# EAGLE schematic Sensor_Module_0x12_U-Value_v1 (EAGLE 9.1.1)
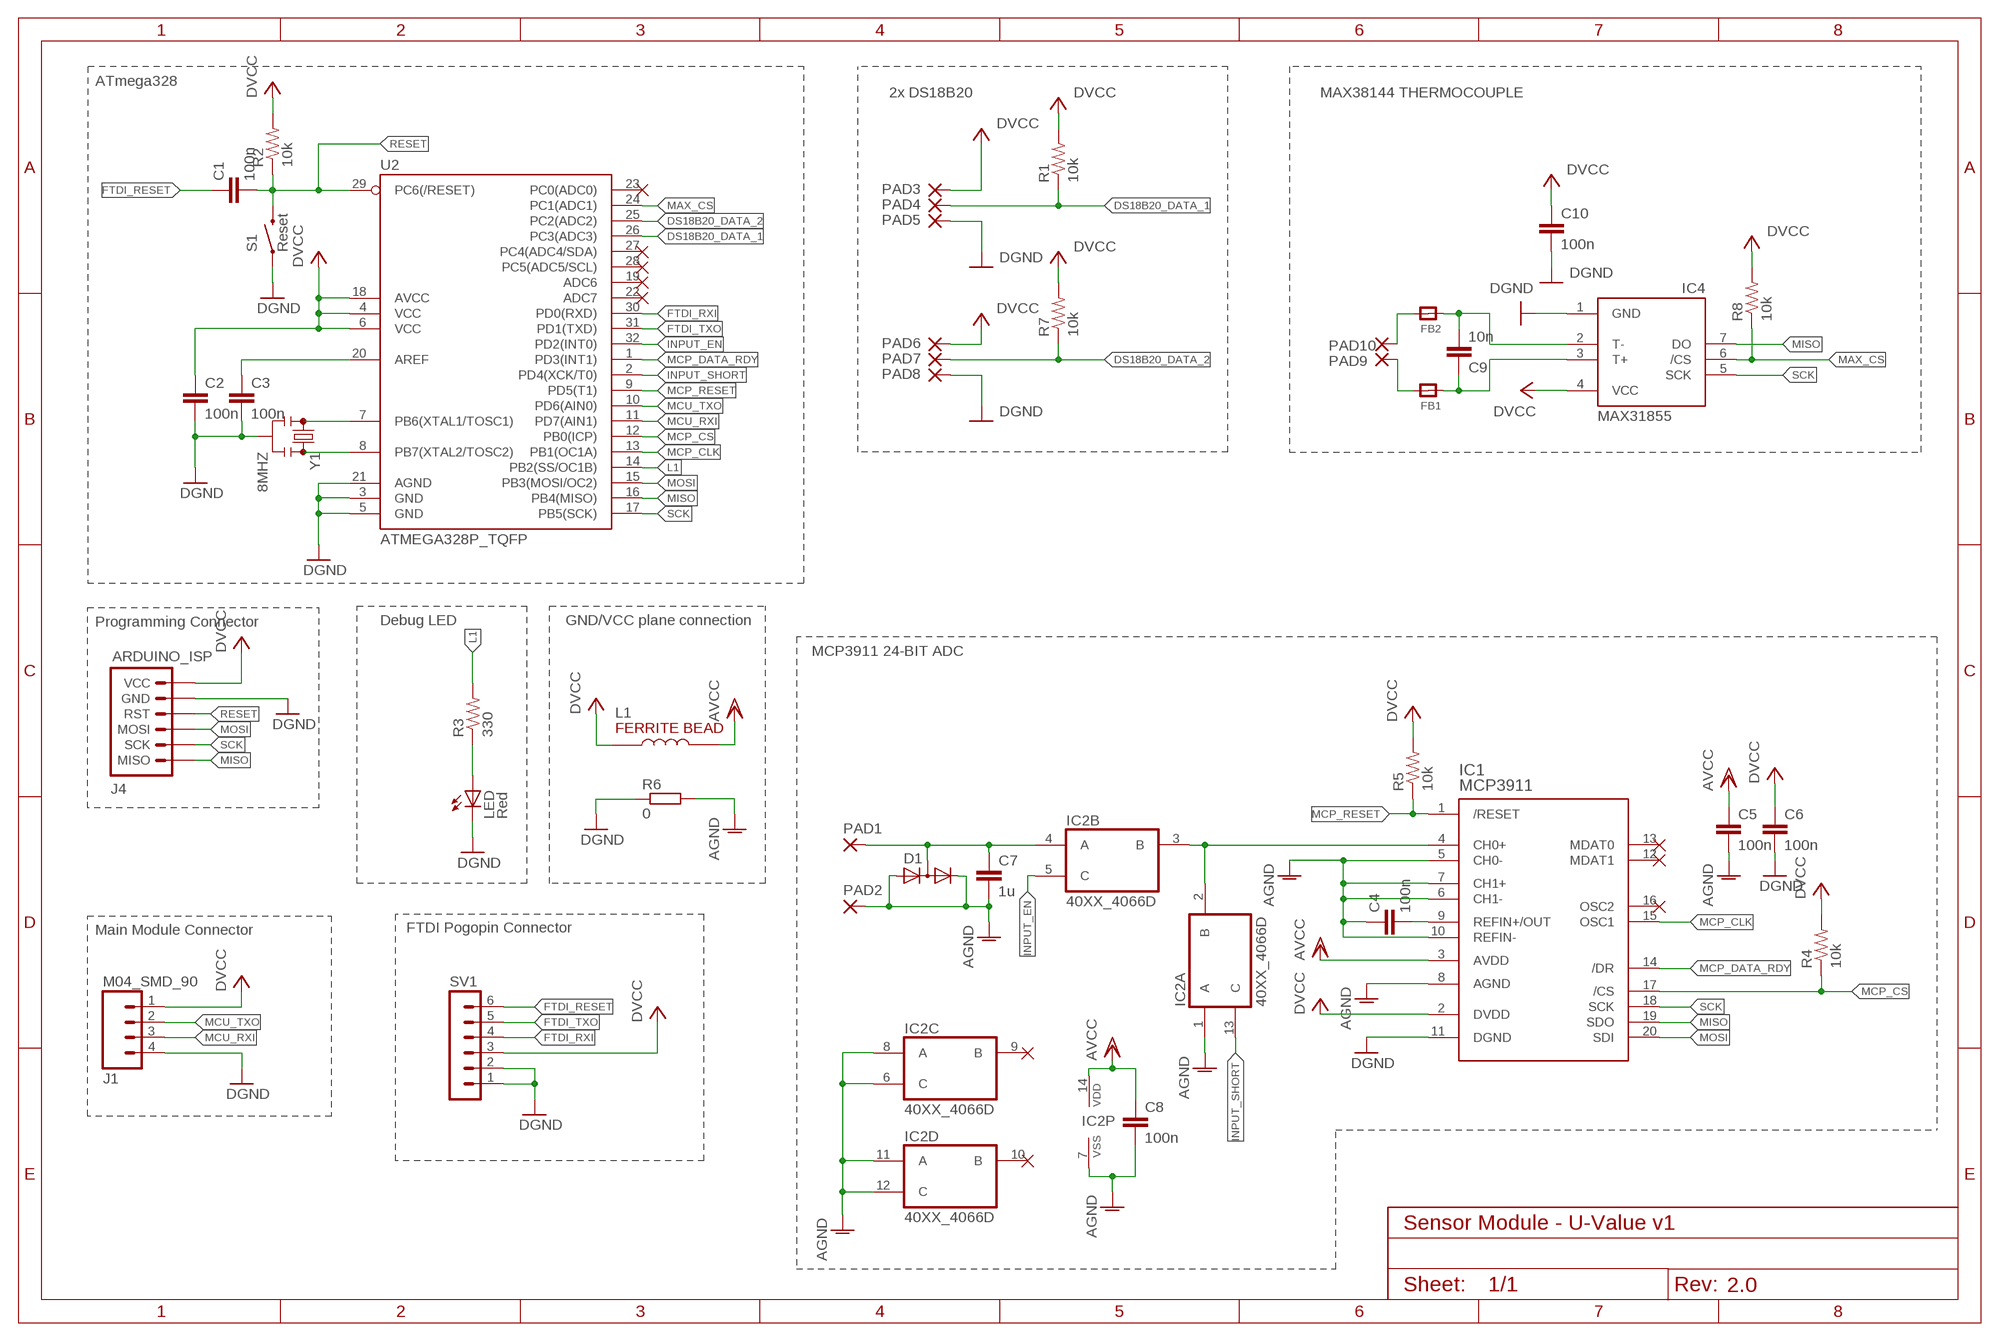
[diagram p0: schematic, sheet 1]
FRAME1 (FRAME-A4L): CNAME: Communication Module; CREVISION: 2.0

## Parts
C1  100n  C  [C0805]
C2  100n  C  [C0805]
C3  100n  C  [C0805]
C4  100n  C  [C0805]
C5  100n  C  [C0805]
C6  100n  C  [C0805]
C7  1u  C  [C0805]
C8  100n  C  [C0805]
C9  10n  C  [C0805]
C10  100n  C  [C0805]
D1  LEDXLAMP_BAV99  [LEDXLAMP_SOT23]
FB1  MICROBUILDER_FERRITE_0805MP  [MICROBUILDER__0805MP]
FB2  MICROBUILDER_FERRITE_0805MP  [MICROBUILDER__0805MP]
IC1  MCP3911  HEATFLOW_MCP3911A0-E/SS  [HEATFLOW_SSOP20]
IC2  40XX_4066D  [40XX_SO14]
IC4  MAX31855  ADAFRUIT_MAX31855  [ADAFRUIT_SO08]
J1  M04_SMD_90  [M04_SMD_90]
J4  ARDUINO_ISP  [M-2X3]
L1  HEATFLOW2_74279220601  [HEATFLOW2_0805]
LED  Red  LEDSML0805  [SML0805]
PAD1  WIREPADSMD1,27-254  [SMD1,27-2,54]
PAD2  WIREPADSMD1,27-254  [SMD1,27-2,54]
PAD3  WIREPADSMD1,27-254  [SMD1,27-2,54]
PAD4  WIREPADSMD1,27-254  [SMD1,27-2,54]
PAD5  WIREPADSMD1,27-254  [SMD1,27-2,54]
PAD6  WIREPADSMD1,27-254  [SMD1,27-2,54]
PAD7  WIREPADSMD1,27-254  [SMD1,27-2,54]
PAD8  WIREPADSMD1,27-254  [SMD1,27-2,54]
PAD9  WIREPADSMD1,27-254  [SMD1,27-2,54]
PAD10  WIREPADSMD1,27-254  [SMD1,27-2,54]
R1  10k  RESISTOR0805-RES  [0805]
R2  10k  RESISTOR0805-RES  [0805]
R3  330  RESISTOR0805-RES  [0805]
R4  10k  RESISTOR0805-RES  [0805]
R5  10k  RESISTOR0805-RES  [0805]
R6  0  RESISTOR_R-EU_M0805  [RESISTOR_M0805]
R7  10k  RESISTOR0805-RES  [0805]
R8  10k  RESISTOR0805-RES  [0805]
S1  Reset  PUSHBUTTON  [M-PUSHBUTTON-SMD]
SV1  MA06-1  [MA06-1]
U2  ATMEGA328P_TQFP  [TQFP32-08]
Y1  8MHZ  RESONATOR8MHZ  [RESONATOR-SMD]

## Nets
AGND: C4.1 C5.2 C7.2 C8.2 D1.1(A) D1.2(C) IC1.5(CH0-) IC1.6(CH1-) IC1.7(CH1+) IC1.8(AGND) IC1.10(REFIN-) IC2.1(A:A) IC2.6(C:C) IC2.7(P:VSS) IC2.8(C:A) IC2.11(D:A) IC2.12(D:C) PAD2.1(P) R6.2
AVCC: C5.1 C8.1 IC1.3(AVDD) IC2.14(P:VDD) L1.2
DGND [GND]: C2.2 C3.2 C6.2 C10.2 IC1.11(DGND) IC4.1(GND) J1.4 J4.P$5(GND) LED.C PAD5.1(P) PAD8.1(P) R6.1 S1.1(LEFT) S1.2(LEFT) SV1.1 SV1.2 U2.3(GND) U2.5(GND) U2.21(AGND) Y1.2
DS18B20_DATA_1: PAD4.1(P) R1.1 U2.26(PC3(ADC3))
DS18B20_DATA_2: PAD7.1(P) R7.1 U2.25(PC2(ADC2))
DVCC [Vsupply]: C2.1 C6.1 C10.1 IC1.2(DVDD) IC4.4(VCC) J1.1 J4.P$6(VCC) L1.1 PAD3.1(P) PAD6.1(P) R1.2 R2.2 R4.2 R5.2 R7.2 R8.2 SV1.3 U2.4(VCC) U2.6(VCC) U2.18(AVCC)
FTDI_RESET: C1.1 SV1.6
FTDI_RXI: SV1.4 U2.30(PD0(RXD))
FTDI_TXO: SV1.5 U2.31(PD1(TXD))
INPUT_EN: IC2.5(B:C) U2.32(PD2(INT0))
INPUT_SHORT: IC2.13(A:C) U2.2(PD4(XCK/T0))
L1: R3.2 U2.14(PB2(SS/OC1B))
MAX_CS: IC4.6(/CS) R8.1 U2.24(PC1(ADC1))
MCP_CLK: IC1.15(OSC1) U2.13(PB1(OC1A))
MCP_CS: IC1.17(/CS) R4.1 U2.12(PB0(ICP))
MCP_DATA_RDY: IC1.14(/DR) U2.1(PD3(INT1))
MCP_RESET: IC1.1(/RESET) R5.1 U2.9(PD5(T1))
MCU_RXI: J1.3 U2.11(PD7(AIN1))
MCU_TXO: J1.2 U2.10(PD6(AIN0))
MISO: IC1.19(SDO) IC4.7(DO) J4.P$1(MISO) U2.16(PB4(MISO))
MOSI: IC1.20(SDI) J4.P$3(MOSI) U2.15(PB3(MOSI/OC2))
N$1: U2.8(PB7(XTAL2/TOSC2)) Y1.3
N$2: U2.7(PB6(XTAL1/TOSC1)) Y1.1
N$3: FB1.1 PAD9.1(P)
N$4: C4.2 IC1.9(REFIN+/OUT)
N$5: IC1.4(CH0+) IC2.2(A:B) IC2.3(B:B)
N$6: C7.1 D1.3(AC) IC2.4(B:A) PAD1.1(P)
N$7: FB2.1 PAD10.1(P)
N$8: C9.2 FB2.2 IC4.2(T-)
N$9: C9.1 FB1.2 IC4.3(T+)
N$15: C3.1 U2.20(AREF)
N$30: LED.A R3.1
RESET: C1.2 J4.P$4(RST) R2.1 S1.3(RIGHT) S1.4(RIGHT) U2.29(PC6(/RESET))
SCK: IC1.18(SCK) IC4.5(SCK) J4.P$2(SCK) U2.17(PB5(SCK))
Unconnected: IC1.12(MDAT1) IC1.13(MDAT0) IC1.16(OSC2) IC2.9(C:B) IC2.10(D:B) U2.19(ADC6) U2.22(ADC7) U2.23(PC0(ADC0)) U2.27(PC4(ADC4/SDA)) U2.28(PC5(ADC5/SCL))

## Notes on the sheet
- ATmega328
- 2x DS18B20 | MAX38144 THERMOCOUPLE
- Programming Connector | Debug LED | GND/VCC plane connection
- MCP3911 24-BIT ADC
- Main Module Connector | FTDI Pogopin Connector
- Sensor Module - U-Value v1
- 2.0

## Library data of the parts
C1-C10 = eagle-ltspice:C: CAPACITOR, European symbol; SPICEMODEL: NONE; SPICEPREFIX: C
D1 = Sensor_Board_0x07_Heat_Flux:LEDXLAMP_BAV99
FB1 FB2 = Adafruit_MAX31855 v2:MICROBUILDER_FERRITE: Ferrite Bead 0603 MMZ1608B121C - 120 Ohm @ 100MHz, 600mA, 0.15 Ohm DC Resistance - Digikey: 445-2164-1-ND BK1608HW121-T - 120 Ohm, 600mA Ferrite Chip - Digikey: 587-1876-2-ND 0805 HZ0805B272R-10 - 2.7K Ohm @ 100MHz, 200mA, 0.8 Ohm DC Resistance - Digikey: 240-2504-1-ND (see also Murata BLM21BD272SN1L) MMZ2012Y152B - 1.5K Ohm @ 100MHz, 500mA, 0.4 Ohm DC Resistance - Digikey: 445-1560-1-ND - Mainly for high frequency (80-400MHz) MMZ2012R102A - 1K Ohm @ 100MHz, 500mA, 0.3 Ohm DC Resistance - Digikey: 445-1555-2-ND - More general purpose (10-200MHz)
IC1 = Sensor_Board_0x07_Heat_Flux:HEATFLOW_MCP3911A0-E/*
IC2 = Sensor_Board_0x07_Heat_Flux:40XX_4066: Quad bilateral ANALOG SWITCH
IC4 = Adafruit_MAX31855 v2:ADAFRUIT_MAX31855
J1 = myownthings:M04_SMD_90
J4 = marc_library:ARDUINO_ISP: AVR ISP 6-pin inline header for Arduino ISP
L1 = Sensor_Board_0x07_Heat_Flux:HEATFLOW2_74279220601: Multilayer Bead SMD, Würth Elektronik Typ: 74279220601
LED = led:LED: LED OSRAM: - CHIPLED LG R971, LG N971, LY N971, LG Q971, LY Q971, LO R971, LY R971 LH N974, LH R974 LS Q976, LO Q976, LY Q976 LO Q996 - Hyper CHIPLED LW Q18S LB Q993, LB Q99A, LB R99A - SideLED LS A670, LO A670, LY A670, LG A670, LP A670 LB A673, LV A673, LT A673, LW A673 LH A674 LY A675 LS A676, LA A676, LO A676, LY A676, LW A676 LS A679, LY A679, LG A679 - Hyper Micro SIDELED® LS Y876, LA Y876, LO Y876, LY Y876 LT Y87S - SmartLED LW L88C, LW L88S LB L89C, LB L89S, LG L890 LS L89K, LO L89K, LY L89K LS L896, LA L896, LO L896, LY L896 - TOPLED LS T670, LO T670, LY T670, LG T670, LP T670 LSG T670, LSP T670, LSY T670, LOP T670, LYG T670 LG T671, LOG T671, LSG T671 LB T673, LV T673, LT T673, LW T673 LH T674 LS T676, LA T676, LO T676, LY T676, LB T676, LH T676, LSB T676, LW T676 LB T67C, LV T67C, LT T67C, LS T67K, LO T67K, LY T67K, LW E67C LS E67B, LA E67B, LO E67B, LY E67B, LB E67C, LV E67C, LT E67C LW T67C LS T679, LY T679, LG T679 LS T770, LO T770, LY T770, LG T770, LP T770 LB T773, LV T773, LT T773, LW T773 LH T774 LS E675, LA E675, LY E675, LS T675 LS T776, LA T776, LO T776, LY T776, LB T776 LHGB T686 LT T68C, LB T68C - Hyper Mini TOPLED® LB M676 - Mini TOPLED Santana® LG M470 LS M47K, LO M47K, LY M47K Source: http://www.osram.convergy.de LUXEON: - LUMILED® LXK2-PW12-R00, LXK2-PW12-S00, LXK2-PW14-U00, LXK2-PW14-V00 LXK2-PM12-R00, LXK2-PM12-S00, LXK2-PM14-U00 LXK2-PE12-Q00, LXK2-PE12-R00, LXK2-PE12-S00, LXK2-PE14-T00, LXK2-PE14-U00 LXK2-PB12-K00, LXK2-PB12-L00, LXK2-PB12-M00, LXK2-PB14-N00, LXK2-PB14-P00, LXK2-PB14-Q00 LXK2-PR12-L00, LXK2-PR12-M00, LXK2-PR14-Q00, LXK2-PR14-R00 LXK2-PD12-Q00, LXK2-PD12-R00, LXK2-PD12-S00 LXK2-PH12-R00, LXK2-PH12-S00 LXK2-PL12-P00, LXK2-PL12-Q00, LXK2-PL12-R00 Source: www.luxeon.com KINGBRIGHT: KA-3528ASYC Source: www.kingbright.com
PAD1-PAD10 = wirepad:WIREPAD: Wire PAD connect wire on PCB
R1-R5 R7 R8 = SparkFun-Passives:RESISTOR: Resistor Basic schematic elements and footprints for 0603, 1206, and PTH resistors.
R6 = Sensor_Board_0x07_Heat_Flux:RESISTOR_R-EU_: RESISTOR, European symbol
S1 = marc_library:PUSHBUTTON
SV1 = con-lstb:MA06-1: PIN HEADER; OC_FARNELL: unknown; OC_NEWARK: unknown
U2 = marc_library:ATMEGA328P_TQFP; PROD_ID: IC-09069
Y1 = marc_library:RESONATOR: Resonator Small SMD resonator. Used, eg, on the Arduino Pro/ Pro Mini boards. 8MHz- XTAL-08895 16MHz- XTAL-08900; PROD_ID: XTAL-08895

## Net classes
0 default: width 0.3 mm
1 Vsupply: width 0.5 mm
5 GND: width 0.5 mm